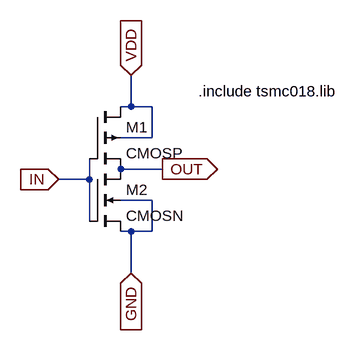
[diagram p0: schematic not.asc]
not.asc, the LTspice schematic file:
Version 4
SHEET 1 880 680
WIRE 208 48 208 0
WIRE 208 48 192 48
WIRE 240 48 208 48
WIRE 240 96 240 48
WIRE 240 96 192 96
WIRE 256 144 192 144
WIRE 144 160 144 128
WIRE 144 160 96 160
WIRE 240 192 192 192
WIRE 144 224 144 160
WIRE 208 240 192 240
WIRE 240 240 240 192
WIRE 240 240 208 240
WIRE 208 304 208 240
FLAG 208 0 VDD
IOPIN 208 0 In
FLAG 208 304 GND
IOPIN 208 304 In
FLAG 96 160 IN
IOPIN 96 160 In
FLAG 256 144 OUT
IOPIN 256 144 Out
SYMBOL cmosp 144 48 R0
SYMATTR InstName M1
SYMATTR Value2 l=180nm w=800nm
SYMBOL cmosn 144 144 R0
SYMATTR InstName M2
SYMATTR Value2 l=180nm w=400nm
TEXT 312 24 Left 2 !.include tsmc018.lib

The netlist it stands for:
* not.asc
M1 VDD IN OUT VDD CMOSP l=180nm w=800nm
M2 OUT IN GND GND CMOSN l=180nm w=400nm
.model NMOS NMOS
.model PMOS PMOS
.lib standard.mos
.include tsmc018.lib
.backanno
.end